# EAGLE schematic AQ_sensor_SIGFOX (EAGLE 9.6.2)
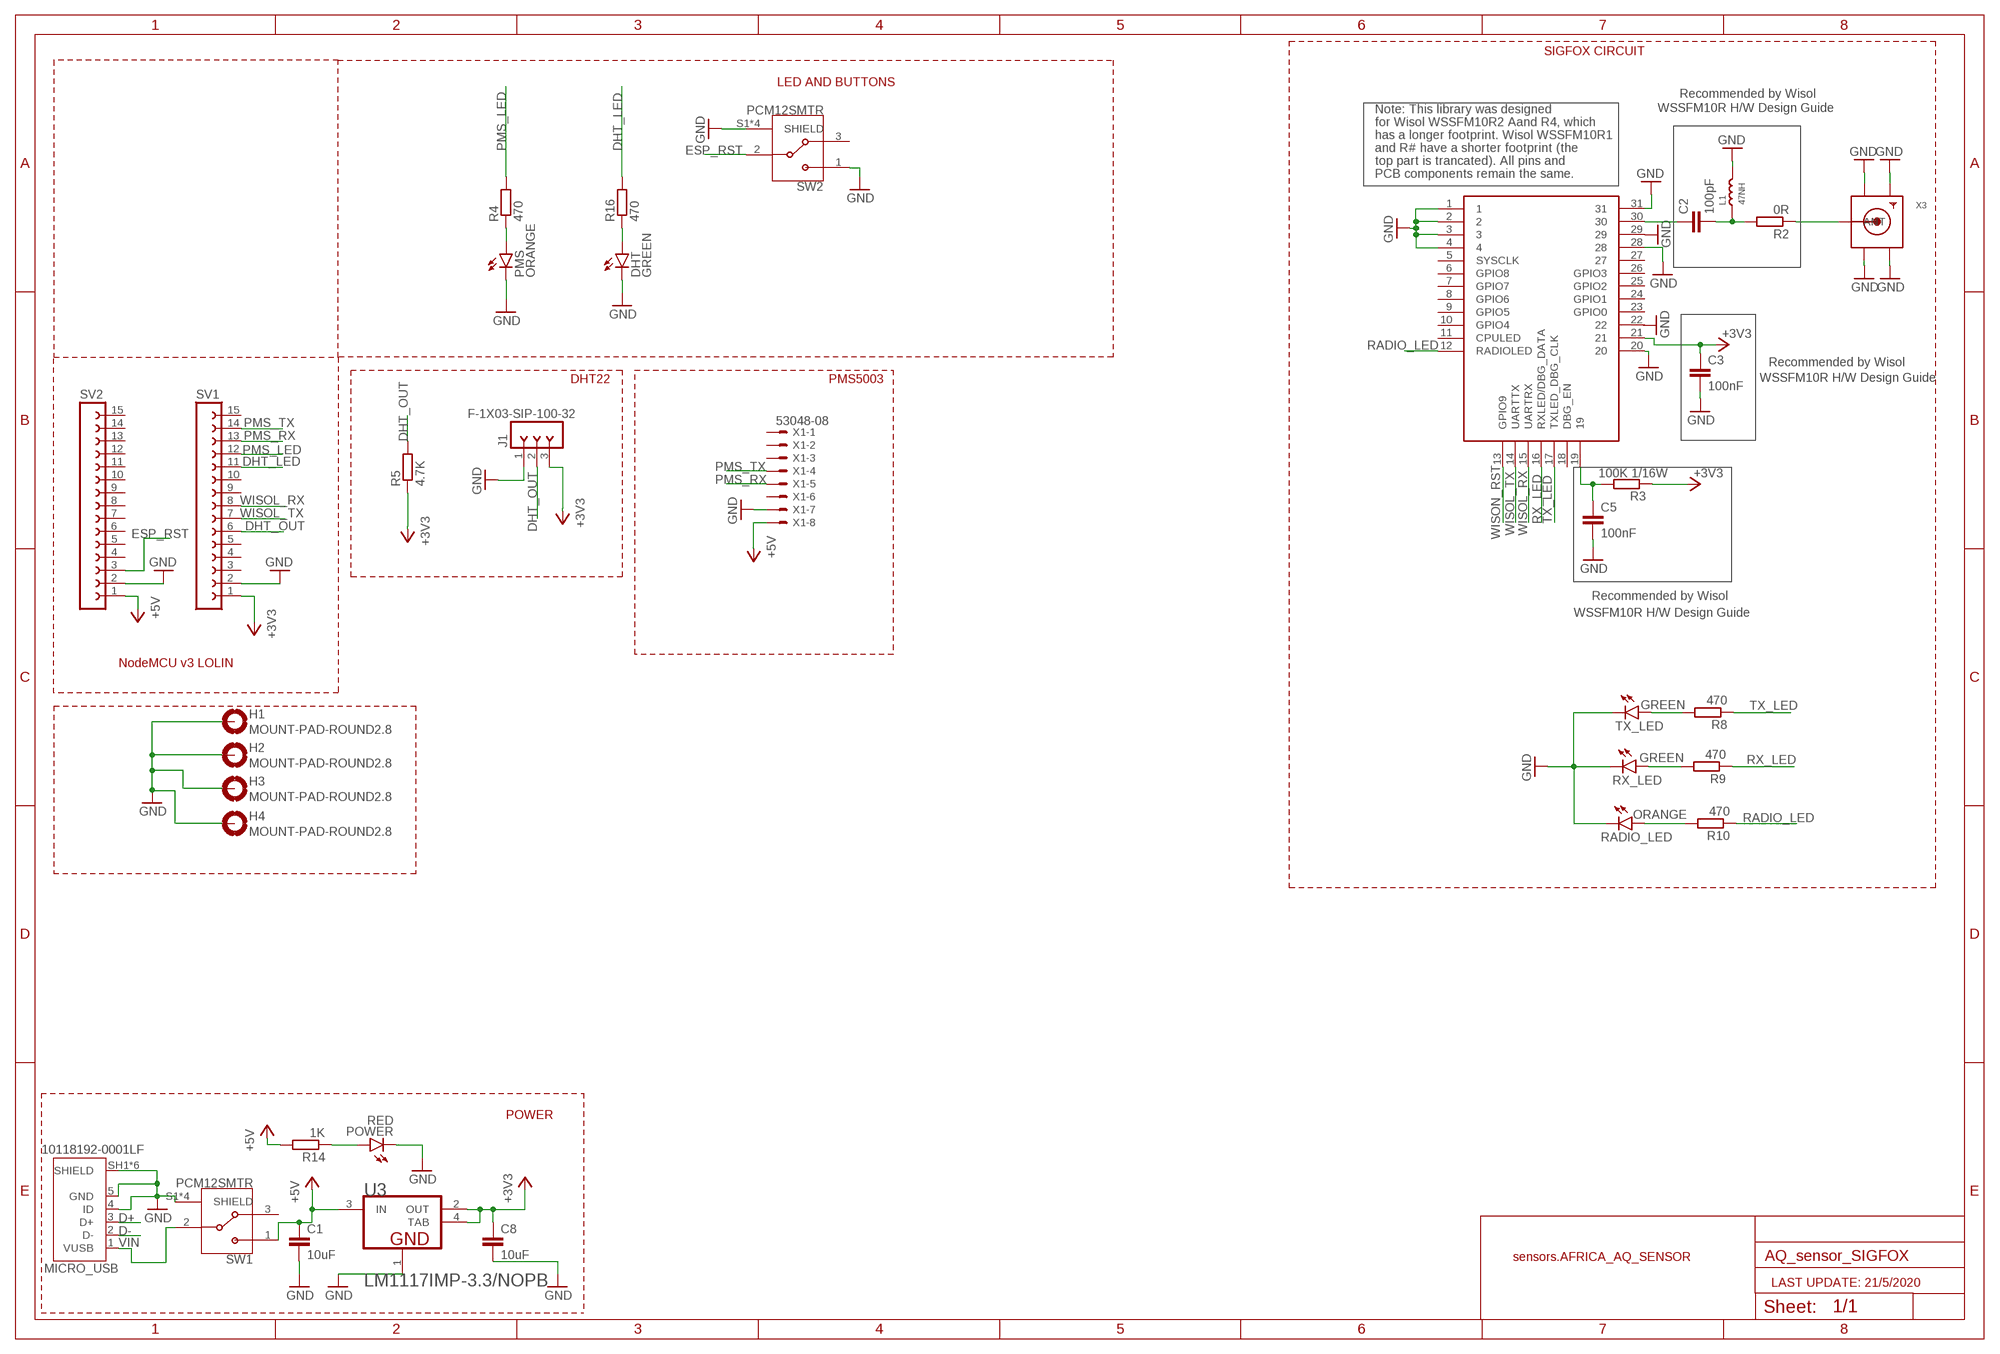
[diagram p0: schematic, sheet 1]

## Parts
C1  10uF  C-EUC0603  [C0603]
C2  100pF  C-EUC0603  [C0603]
C3  100nF  C-EUC0603  [C0603]
C5  100nF  C-EUC0603  [C0603]
C8  10uF  C-EUC0603  [C0603]
DHT  GREEN  LEDCHIP-LED0603  [CHIP-LED0603]
H1  MOUNT-PAD-ROUND2.8  [2,8-PAD]
H2  MOUNT-PAD-ROUND2.8  [2,8-PAD]
H3  MOUNT-PAD-ROUND2.8  [2,8-PAD]
H4  MOUNT-PAD-ROUND2.8  [2,8-PAD]
J1  F-1X03-SIP-100-32  [SIP-100-03-32]
L1  47NH  SMD-INDUCTOR-2.2UH-20%-1.2A(0805)  [L0805]
MICRO_USB  10118192-0001LF  [AMPHENOL_10118192-0001LF]
PMS  ORANGE  LEDCHIP-LED0603  [CHIP-LED0603]
POWER  RED  LEDCHIP-LED0603  [CHIP-LED0603]
R2  0R  R-EU_R0603  [R0603]
R3  100K 1/16W  R-EU_R0603  [R0603]
R4  470  R-EU_R0603  [R0603]
R5  4.7K  R-EU_R0603  [R0603]
R8  470  R-EU_R0603  [R0603]
R9  470  R-EU_R0603  [R0603]
R10  470  R-EU_R0603  [R0603]
R14  1K  R-EU_R0603  [R0603]
R16  470  R-EU_R0603  [R0603]
RADIO_LED  ORANGE  LEDCHIP-LED0603  [CHIP-LED0603]
RX_LED  GREEN  LEDCHIP-LED0603  [CHIP-LED0603]
SV1  FE15-1  [FE15]
SV2  FE15-1  [FE15]
SW1  PCM12SMTR  [SW_PCM12SMTR]
SW2  PCM12SMTR  [SW_PCM12SMTR]
TX_LED  GREEN  LEDCHIP-LED0603  [CHIP-LED0603]
U3  TEXAS_INSTRUMENTS_LM1117IMP-3.3-NOPBTEXAS_INSTRUMENTS_LM1117IMP-3.3-NOPB_0_0  [TEXAS_INSTRUMENTS_LM1117IMP-3.3-NOPB_0]
U$1  WSSFM10RWSSFM10R2R4  [WSSFM10R]
X1  53048-08  [53048-08]
X3  SMACONNECTOR_EDGE_UFL  [SMA_EDGELAUNCH_UFL]

## Nets
+3V3 [POWER]: C3.1 C8.1 J1.3 R3.1 R5.1 SV1.1 U3.2(OUT) U3.4(TAB) U$1.21
+5V [POWER]: C1.1 R14.2 SV2.1 SW1.1 U3.3(IN) X1.8
D+: MICRO_USB.3(D+)
D-: MICRO_USB.2(D-)
DHT_LED: R16.2 SV1.11
DHT_OUT: J1.2 R5.2 SV1.6
ESP_RST: SV2.3 SW2.2
GND [BGA]: C1.2 C3.2 C5.2 C8.2 DHT.C H1.B2,8(MOUNT) H2.B2,8(MOUNT) H3.B2,8(MOUNT) H4.B2,8(MOUNT) J1.1 L1.2 MICRO_USB.4(ID) MICRO_USB.5(GND) MICRO_USB.SH1(SHIELD) MICRO_USB.SH2(SHIELD) MICRO_USB.SH3(SHIELD) MICRO_USB.SH4(SHIELD) MICRO_USB.SH5(SHIELD) MICRO_USB.SH6(SHIELD) PMS.C POWER.C RADIO_LED.C RX_LED.C SV1.2 SV2.2 SW1.S1(SHIELD) SW1.S2(SHIELD) SW1.S3(SHIELD) SW1.S4(SHIELD) SW2.1 SW2.S1(SHIELD) SW2.S2(SHIELD) SW2.S3(SHIELD) SW2.S4(SHIELD) TX_LED.C U3.1(GND) U$1.1 U$1.2 U$1.3 U$1.4 U$1.20 U$1.28 U$1.29 U$1.31 X1.7 X3.GND@1(GND1) X3.GND@2(GND2) X3.GND@3(GND3) X3.GND@4(GND4)
N$1: C2.1 U$1.30
N$2: C2.2 L1.1 R2.2
N$3: R2.1 X3.P(ANT)
N$4: PMS.A R4.1
N$5: C5.1 R3.2 U$1.19
N$7: R10.2 RADIO_LED.A
N$8: R9.2 RX_LED.A
N$15: R8.2 TX_LED.A
N$25: POWER.A R14.1
N$27: DHT.A R16.1
PMS_LED: R4.2 SV1.12
PMS_RX: SV1.13 X1.5
PMS_TX: SV1.14 X1.4
RADIO_LED: R10.1 U$1.12(RADIOLED)
RX_LED: R9.1 U$1.16(RXLED/DBG_DATA)
TX_LED: R8.1 U$1.17(TXLED_DBG_CLK)
VIN: MICRO_USB.1(VUSB) SW1.2
WISOL_RX: SV1.8 U$1.15(UARTRX)
WISOL_TX: SV1.7 U$1.14(UARTTX)
WISON_RST: U$1.13(GPIO9)
Unconnected: SV1.3 SV1.4 SV1.5 SV1.9 SV1.10 SV1.15 SV2.4 SV2.5 SV2.6 SV2.7 SV2.8 SV2.9 SV2.10 SV2.11 SV2.12 SV2.13 SV2.14 SV2.15 SW1.3 SW2.3 U$1.5(SYSCLK) U$1.6(GPIO8) U$1.7(GPIO7) U$1.8(GPIO6) U$1.9(GPIO5) U$1.10(GPIO4) U$1.11(CPULED) U$1.18(DBG_EN) U$1.22 U$1.23(GPIO0) U$1.24(GPIO1) U$1.25(GPIO2) U$1.26(GPIO3) U$1.27 X1.1 X1.2 X1.3 X1.6

## Notes on the sheet
- SIGFOX CIRCUIT
- LED AND BUTTONS
- Recommended by Wisol
- Note: This library was designed | WSSFM10R H/W Design Guide
- for Wisol WSSFM10R2 Aand R4, which
- has a longer footprint. Wisol WSSFM10R1
- and R# have a shorter footprint (the
- top part is trancated). All pins and
- PCB components remain the same.
- Recommended by Wisol
- DHT22 | PMS5003 | WSSFM10R H/W Design Guide
- Recommended by Wisol
- WSSFM10R H/W Design Guide
- NodeMCU v3 LOLIN
- POWER
- sensors.AFRICA_AQ_SENSOR
- LAST UPDATE: 21/5/2020

## Library data of the parts
C1-C3 C5 C8 = rcl:C-EU: CAPACITOR, European symbol; SPICEPREFIX: C
DHT PMS POWER RADIO_LED RX_LED TX_LED = led:LED: LED OSRAM: - CHIPLED LG R971, LG N971, LY N971, LG Q971, LY Q971, LO R971, LY R971 LH N974, LH R974 LS Q976, LO Q976, LY Q976 LO Q996 - Hyper CHIPLED LW Q18S LB Q993, LB Q99A, LB R99A - SideLED LS A670, LO A670, LY A670, LG A670, LP A670 LB A673, LV A673, LT A673, LW A673 LH A674 LY A675 LS A676, LA A676, LO A676, LY A676, LW A676 LS A679, LY A679, LG A679 - Hyper Micro SIDELED® LS Y876, LA Y876, LO Y876, LY Y876 LT Y87S - SmartLED LW L88C, LW L88S LB L89C, LB L89S, LG L890 LS L89K, LO L89K, LY L89K LS L896, LA L896, LO L896, LY L896 - TOPLED LS T670, LO T670, LY T670, LG T670, LP T670 LSG T670, LSP T670, LSY T670, LOP T670, LYG T670 LG T671, LOG T671, LSG T671 LB T673, LV T673, LT T673, LW T673 LH T674 LS T676, LA T676, LO T676, LY T676, LB T676, LH T676, LSB T676, LW T676 LB T67C, LV T67C, LT T67C, LS T67K, LO T67K, LY T67K, LW E67C LS E67B, LA E67B, LO E67B, LY E67B, LB E67C, LV E67C, LT E67C LW T67C LS T679, LY T679, LG T679 LS T770, LO T770, LY T770, LG T770, LP T770 LB T773, LV T773, LT T773, LW T773 LH T774 LS E675, LA E675, LY E675, LS T675 LS T776, LA T776, LO T776, LY T776, LB T776 LHGB T686 LT T68C, LB T68C - Hyper Mini TOPLED® LB M676 - Mini TOPLED Santana® LG M470 LS M47K, LO M47K, LY M47K Source: http://www.osram.convergy.de LUXEON: - LUMILED® LXK2-PW12-R00, LXK2-PW12-S00, LXK2-PW14-U00, LXK2-PW14-V00 LXK2-PM12-R00, LXK2-PM12-S00, LXK2-PM14-U00 LXK2-PE12-Q00, LXK2-PE12-R00, LXK2-PE12-S00, LXK2-PE14-T00, LXK2-PE14-U00 LXK2-PB12-K00, LXK2-PB12-L00, LXK2-PB12-M00, LXK2-PB14-N00, LXK2-PB14-P00, LXK2-PB14-Q00 LXK2-PR12-L00, LXK2-PR12-M00, LXK2-PR14-Q00, LXK2-PR14-R00 LXK2-PD12-Q00, LXK2-PD12-R00, LXK2-PD12-S00 LXK2-PH12-R00, LXK2-PH12-S00 LXK2-PL12-P00, LXK2-PL12-Q00, LXK2-PL12-R00 Source: www.luxeon.com KINGBRIGHT: KA-3528ASYC Source: www.kingbright.com
H1-H4 = AQ_sensor_GSM:MOUNT-PAD-ROUND: MOUNTING PAD, round
J1 = AQ_sensor_GSM:F-1X03-: FEMALE HEADER
L1 = OPL_Inductor:SMD-INDUCTOR-2.2UH-20%-1.2A(0805): 303010086; MPN: LQM2MPN2R2MG0; VALUE: 2.2UH-1.2A
MICRO_USB = AQ_sensor_GSM:10118192-0001LF: Single Port 5 Contact Horizontal Right Angle Shielded Micro B USB 2.0 Connector; AVAILABILITY: Unavailable; DESCRIPTION: USB - micro B USB 2.0 Receptacle Connector 5 Position Surface Mount, Right Angle; MF: Amphenol ICC; MP: 10118192-0001LF; PACKAGE: None; PRICE: None
R2-R5 R8-R10 R14 R16 = rcl:R-EU_: RESISTOR, European symbol; SPICEPREFIX: R
SV1 SV2 = AQ_sensor_GSM:FE15-1: FEMALE HEADER; OC_FARNELL: unknown; OC_NEWARK: unknown
SW1 SW2 = AQ_sensor_GSM:PCM12SMTR: Switch Slide ON ON SPDT Side Slide 0.3A 6VDC 10000Cycles Gull Wing SMD T/R; AVAILABILITY: Unavailable; DESCRIPTION: Slide Switch SPDT Surface Mount, Right Angle; MF: C&K; MP: PCM12SMTR; PACKAGE: DO-201 C&amp;K Components; PRICE: None
U3 = AQ_sensor_GSM:TEXAS_INSTRUMENTS_LM1117IMP-3.3-NOPB: PM-REG-LM1086-SOT4; CIIVA_IDS: 19361124; CODE__IPC: SOT223-4; CODE__JEDEC: TO-261-AA; COMPONENT_LINK_1_DESCRIPTION: Datasheet URL; COMPONENT_LINK_1_URL: http://www.ti.com/general/docs/lit/getliterature.tsp?genericPartNumber=LM1117-N&fileType=pdf; COMP_TYPE: LDO IC; FOOTPRINT_VARIANT_NAME_0: Level C; FOOTPRINT_VARIANT_NAME_1: Level B; FOOTPRINT_VARIANT_NAME_2: Level A; HIGH__RELIABILITY: Y; IMPORTED: yes; IMPORTED_FROM: vault; IMPORT_TS: 1521845365; MF: Texas Instruments; MPN: LM1117IMP-3.3/NOPB; PACKAGE: DCY0004A; PACKAGE_DESCRIPTION: Molded SOT-223, 6.50 x 3.56 x 1.6mm Body, 4 Lead, 2.3mm Pitch; PACKAGE_TOP_MARKING: XYTT*N05B; PIN_COUNT: 4; POWER_WISE: N; PREFIX: U; RELEASE_DATE: 1464077430; ROHS: Yes; VAULT_GUID: 7E820BF6-F141-44C1-8A74-392CB201F257; VAULT_REVISION: 16019014-2FBF-4157-ADF5-B132B4DC413A
U$1 = WisolWSSFM10R:WSSFM10R
X1 = AQ_sensor_GSM:53?-08: CONNECTOR wire to board 1.25 mm (.049 inch) pitch header; MF: WALDOM/MOLEX; MPN: 53048-0810; OC_FARNELL: 9733094; OC_NEWARK: 38C9913
X3 = AQ_sensor_GSM:SMACONNECTOR: SMA Connector 90° DIP SMA Connector, 50 Ohm (4UConnector: 07259)

## Net classes
0 default: width 0.3 mm, drill 0.3 mm, clearance 0.2 mm
1 POWER: width 0.4 mm, drill 0.3 mm, clearance 0.2 mm to class 0, clearance 0.2 mm